# Altium schematic sheet Saturn_Cartage.SchDoc
size A3
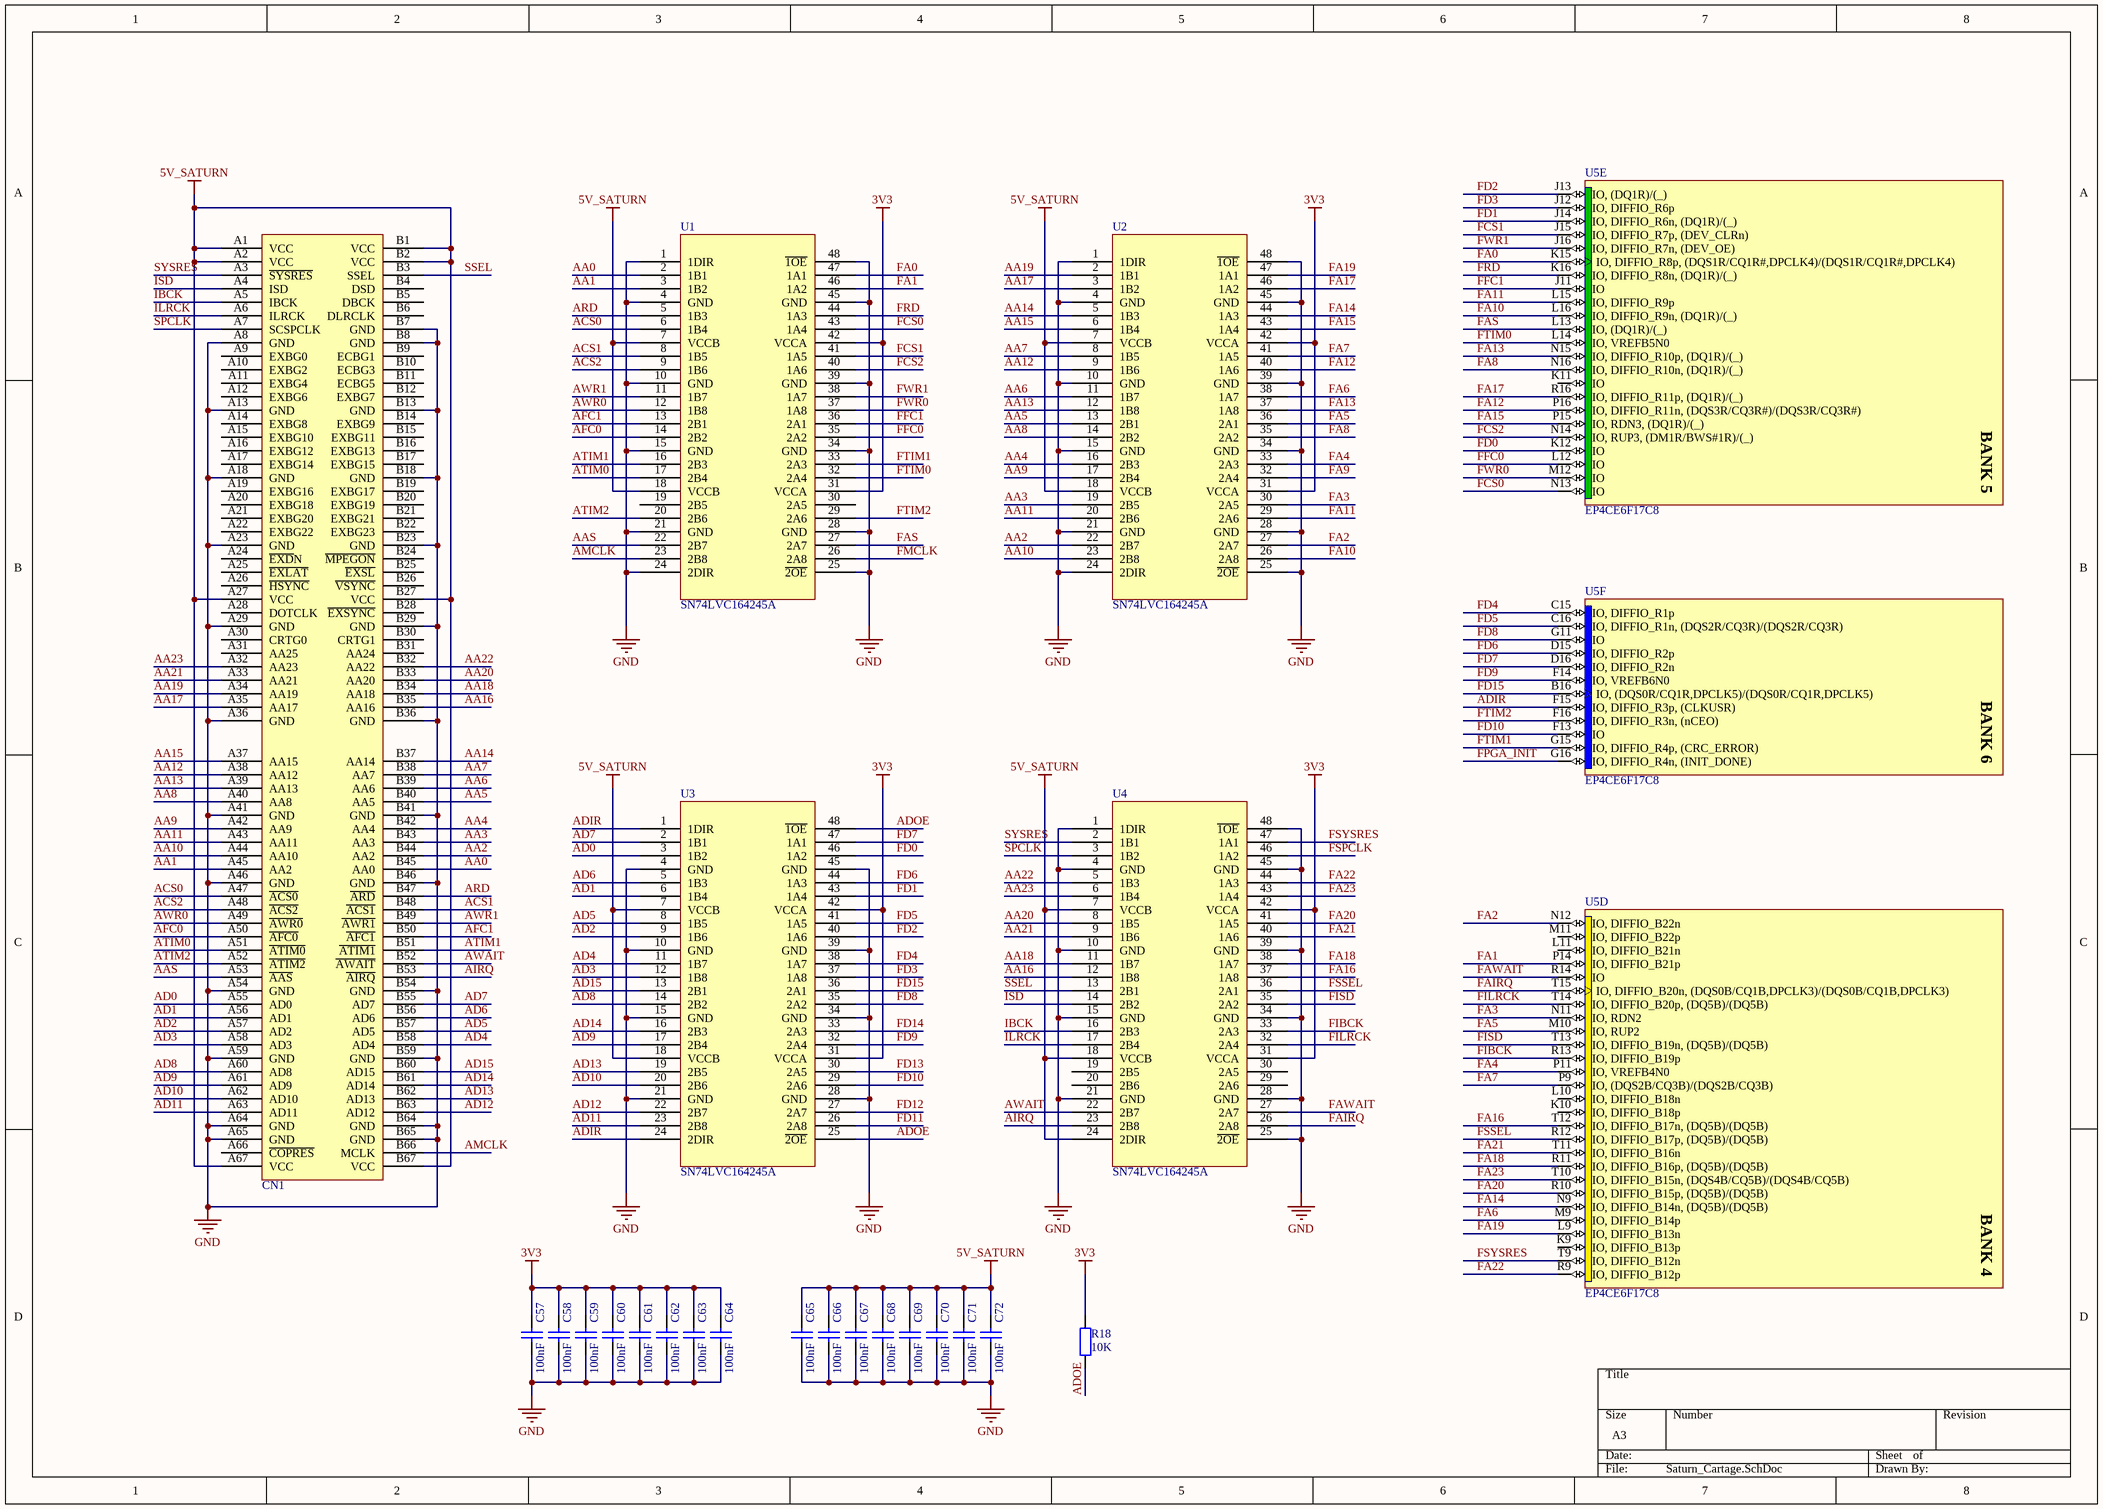
[diagram p0: Saturn_Cartage.SchDoc]

## Parts
C57  100nF  [C0603]
C58  100nF  [C0603]
C59  100nF  [C0603]
C60  100nF  [C0603]
C61  100nF  [C0603]
C62  100nF  [C0603]
C63  100nF  [C0603]
C64  100nF  [C0603]
C65  100nF  [C0603]
C66  100nF  [C0603]
C67  100nF  [C0603]
C68  100nF  [C0603]
C69  100nF  [C0603]
C70  100nF  [C0603]
C71  100nF  [C0603]
C72  100nF  [C0603]
CN1  SaturnCartage  [Saturn_cart]  (value not drawn)
R18  10K  [R0603]
U1  SN74LVC164245A  [DGG048]
U2  SN74LVC164245A  [DGG048]
U3  SN74LVC164245A  [DGG048]
U4  SN74LVC164245A  [DGG048]
U5  EP4CE6F17C8  [FBGA256]  (parts D,E,F of 13)

## Nets
3V3: C57.2 C58.2 C59.2 C60.2 C61.2 C62.2 C63.2 C64.2 R18.2 U1.31(VCCA) U1.42(VCCA) U2.31(VCCA) U2.42(VCCA) U3.31(VCCA) U3.42(VCCA) U4.31(VCCA) U4.42(VCCA)
5V_SATURN: C65.2 C66.2 C67.2 C68.2 C69.2 C70.2 C71.2 C72.2 CN1.A1(VCC) CN1.A2(VCC) CN1.A27(VCC) CN1.A67(VCC) CN1.B1(VCC) CN1.B2(VCC) CN1.B27(VCC) CN1.B67(VCC) U1.7(VCCB) U1.18(VCCB) U2.7(VCCB) U2.18(VCCB) U3.7(VCCB) U3.18(VCCB) U4.7(VCCB) U4.18(VCCB) U4.24(2DIR)
GND: C57.1 C58.1 C59.1 C60.1 C61.1 C62.1 C63.1 C64.1 C65.1 C66.1 C67.1 C68.1 C69.1 C70.1 C71.1 C72.1 CN1.A8(GND) CN1.A13(GND) CN1.A18(GND) CN1.A23(GND) CN1.A29(GND) CN1.A36(GND) CN1.A41(GND) CN1.A46(GND) CN1.A54(GND) CN1.A59(GND) CN1.A64(GND) CN1.A65(GND) CN1.B7(GND) CN1.B8(GND) CN1.B13(GND) CN1.B18(GND) CN1.B23(GND) CN1.B29(GND) CN1.B36(GND) CN1.B41(GND) CN1.B46(GND) CN1.B54(GND) CN1.B59(GND) CN1.B64(GND) CN1.B65(GND) U1.1(1DIR) U1.4(GND) U1.10(GND) U1.15(GND) U1.21(GND) U1.24(2DIR) U1.25(~{2OE}) U1.28(GND) U1.34(GND) U1.39(GND) U1.45(GND) U1.48(~{1OE}) U2.1(1DIR) U2.4(GND) U2.10(GND) U2.15(GND) U2.21(GND) U2.24(2DIR) U2.25(~{2OE}) U2.28(GND) U2.34(GND) U2.39(GND) U2.45(GND) U2.48(~{1OE}) U3.4(GND) U3.10(GND) U3.15(GND) U3.21(GND) U3.28(GND) U3.34(GND) U3.39(GND) U3.45(GND) U4.1(1DIR) U4.4(GND) U4.10(GND) U4.15(GND) U4.21(GND) U4.25(~{2OE}) U4.28(GND) U4.34(GND) U4.39(GND) U4.45(GND) U4.48(~{1OE})
AA0: CN1.B45(AA0) U1.2(1B1)
AA1: CN1.A45(AA2) U1.3(1B2)
AA2: CN1.B44(AA2) U2.22(2B7)
AA3: CN1.B43(AA3) U2.19(2B5)
AA4: CN1.B42(AA4) U2.16(2B3)
AA5: CN1.B40(AA5) U2.13(2B1)
AA6: CN1.B39(AA6) U2.11(1B7)
AA7: CN1.B38(AA7) U2.8(1B5)
AA8: CN1.A40(AA8) U2.14(2B2)
AA9: CN1.A42(AA9) U2.17(2B4)
AA10: CN1.A44(AA10) U2.23(2B8)
AA11: CN1.A43(AA11) U2.20(2B6)
AA12: CN1.A38(AA12) U2.9(1B6)
AA13: CN1.A39(AA13) U2.12(1B8)
AA14: CN1.B37(AA14) U2.5(1B3)
AA15: CN1.A37(AA15) U2.6(1B4)
AA16: CN1.B35(AA16) U4.12(1B8)
AA17: CN1.A35(AA17) U2.3(1B2)
AA18: CN1.B34(AA18) U4.11(1B7)
AA19: CN1.A34(AA19) U2.2(1B1)
AA20: CN1.B33(AA20) U4.8(1B5)
AA21: CN1.A33(AA21) U4.9(1B6)
AA22: CN1.B32(AA22) U4.5(1B3)
AA23: CN1.A32(AA23) U4.6(1B4)
AAS: CN1.A53(~{AAS}) U1.22(2B7)
ACS0: CN1.A47(~{ACS0}) U1.6(1B4)
ACS1: CN1.B48(~{ACS1}) U1.8(1B5)
ACS2: CN1.A48(~{ACS2}) U1.9(1B6)
AD0: CN1.A55(AD0) U3.3(1B2)
AD1: CN1.A56(AD1) U3.6(1B4)
AD2: CN1.A57(AD2) U3.9(1B6)
AD3: CN1.A58(AD3) U3.12(1B8)
AD4: CN1.B58(AD4) U3.11(1B7)
AD5: CN1.B57(AD5) U3.8(1B5)
AD6: CN1.B56(AD6) U3.5(1B3)
AD7: CN1.B55(AD7) U3.2(1B1)
AD8: CN1.A60(AD8) U3.14(2B2)
AD9: CN1.A61(AD9) U3.17(2B4)
AD10: CN1.A62(AD10) U3.20(2B6)
AD11: CN1.A63(AD11) U3.23(2B8)
AD12: CN1.B63(AD12) U3.22(2B7)
AD13: CN1.B62(AD13) U3.19(2B5)
AD14: CN1.B61(AD14) U3.16(2B3)
AD15: CN1.B60(AD15) U3.13(2B1)
ADIR: U3.1(1DIR) U3.24(2DIR) U5.F15(IO,_DIFFIO_R3p,_(CLKUSR))
ADOE: R18.1 U3.25(~{2OE}) U3.48(~{1OE})
AFC0: CN1.A50(~{AFC0}) U1.14(2B2)
AFC1: CN1.B50(~{AFC1}) U1.13(2B1)
AIRQ: CN1.B53(~{AIRQ}) U4.23(2B8)
AMCLK: CN1.B66(MCLK) U1.23(2B8)
ARD: CN1.B47(~{ARD}) U1.5(1B3)
ATIM0: CN1.A51(~{ATIM0}) U1.17(2B4)
ATIM1: CN1.B51(~{ATIM1}) U1.16(2B3)
ATIM2: CN1.A52(~{ATIM2}) U1.20(2B6)
AWAIT: CN1.B52(~{AWAIT}) U4.22(2B7)
AWR0: CN1.A49(~{AWR0}) U1.12(1B8)
AWR1: CN1.B49(~{AWR1}) U1.11(1B7)
FA0: U1.47(1A1) U5.K15(IO,_DIFFIO_R8p,_(DQS1R/CQ1R#,DPCLK4)/(DQS1R/CQ1R#,DPCLK4))
FA1: U1.46(1A2) U5.P14(IO,_DIFFIO_B21p)
FA2: U2.27(2A7) U5.N12(IO,_DIFFIO_B22n)
FA3: U2.30(2A5) U5.N11(IO,_RDN2)
FA4: U2.33(2A3) U5.P11(IO,_VREFB4N0)
FA5: U2.36(2A1) U5.M10(IO,_RUP2)
FA6: U2.38(1A7) U5.M9(IO,_DIFFIO_B14p)
FA7: U2.41(1A5) U5.P9(IO,_(DQS2B/CQ3B)/(DQS2B/CQ3B))
FA8: U2.35(2A2) U5.N16(IO,_DIFFIO_R10n,_(DQ1R)/(_))
FA9: U2.32(2A4)
FA10: U2.26(2A8) U5.L16(IO,_DIFFIO_R9n,_(DQ1R)/(_))
FA11: U2.29(2A6) U5.L15(IO,_DIFFIO_R9p)
FA12: U2.40(1A6) U5.P16(IO,_DIFFIO_R11n,_(DQS3R/CQ3R#)/(DQS3R/CQ3R#))
FA13: U2.37(1A8) U5.N15(IO,_DIFFIO_R10p,_(DQ1R)/(_))
FA14: U2.44(1A3) U5.N9(IO,_DIFFIO_B14n,_(DQ5B)/(DQ5B))
FA15: U2.43(1A4) U5.P15(IO,_RDN3,_(DQ1R)/(_))
FA16: U4.37(1A8) U5.T12(IO,_DIFFIO_B17n,_(DQ5B)/(DQ5B))
FA17: U2.46(1A2) U5.R16(IO,_DIFFIO_R11p,_(DQ1R)/(_))
FA18: U4.38(1A7) U5.R11(IO,_DIFFIO_B16p,_(DQ5B)/(DQ5B))
FA19: U2.47(1A1) U5.L9(IO,_DIFFIO_B13n)
FA20: U4.41(1A5) U5.R10(IO,_DIFFIO_B15p,_(DQ5B)/(DQ5B))
FA21: U4.40(1A6) U5.T11(IO,_DIFFIO_B16n)
FA22: U4.44(1A3) U5.R9(IO,_DIFFIO_B12p)
FA23: U4.43(1A4) U5.T10(IO,_DIFFIO_B15n,_(DQS4B/CQ5B)/(DQS4B/CQ5B))
FAIRQ: U4.26(2A8) U5.T15(IO,_DIFFIO_B20n,_(DQS0B/CQ1B,DPCLK3)/(DQS0B/CQ1B,DPCLK3))
FAS: U1.27(2A7) U5.L13(IO,_(DQ1R)/(_))
FAWAIT: U4.27(2A7) U5.R14(IO)
FCS0: U1.43(1A4) U5.N13(IO)
FCS1: U1.41(1A5) U5.J15(IO,_DIFFIO_R7p,_(DEV_CLRn))
FCS2: U1.40(1A6) U5.N14(IO,_RUP3,_(DM1R/BWS#1R)/(_))
FD0: U3.46(1A2) U5.K12(IO)
FD1: U3.43(1A4) U5.J14(IO,_DIFFIO_R6n,_(DQ1R)/(_))
FD2: U3.40(1A6) U5.J13(IO,_(DQ1R)/(_))
FD3: U3.37(1A8) U5.J12(IO,_DIFFIO_R6p)
FD4: U3.38(1A7) U5.C15(IO,_DIFFIO_R1p)
FD5: U3.41(1A5) U5.C16(IO,_DIFFIO_R1n,_(DQS2R/CQ3R)/(DQS2R/CQ3R))
FD6: U3.44(1A3) U5.D15(IO,_DIFFIO_R2p)
FD7: U3.47(1A1) U5.D16(IO,_DIFFIO_R2n)
FD8: U3.35(2A2) U5.G11(IO)
FD9: U3.32(2A4) U5.F14(IO,_VREFB6N0)
FD10: U3.29(2A6) U5.F13(IO)
FD11: U3.26(2A8)
FD12: U3.27(2A7)
FD13: U3.30(2A5)
FD14: U3.33(2A3)
FD15: U3.36(2A1) U5.B16(IO,_(DQS0R/CQ1R,DPCLK5)/(DQS0R/CQ1R,DPCLK5))
FFC0: U1.35(2A2) U5.L12(IO)
FFC1: U1.36(2A1) U5.J11(IO)
FIBCK: U4.33(2A3) U5.R13(IO,_DIFFIO_B19p)
FILRCK: U4.32(2A4) U5.T14(IO,_DIFFIO_B20p,_(DQ5B)/(DQ5B))
FISD: U4.35(2A2) U5.T13(IO,_DIFFIO_B19n,_(DQ5B)/(DQ5B))
FMCLK: U1.26(2A8)
FPGA_INIT: U5.G16(IO,_DIFFIO_R4n,_(INIT_DONE))
FRD: U1.44(1A3) U5.K16(IO,_DIFFIO_R8n,_(DQ1R)/(_))
FSPCLK: U4.46(1A2)
FSSEL: U4.36(2A1) U5.R12(IO,_DIFFIO_B17p,_(DQ5B)/(DQ5B))
FSYSRES: U4.47(1A1) U5.T9(IO,_DIFFIO_B12n)
FTIM0: U1.32(2A4) U5.L14(IO,_VREFB5N0)
FTIM1: U1.33(2A3) U5.G15(IO,_DIFFIO_R4p,_(CRC_ERROR))
FTIM2: U1.29(2A6) U5.F16(IO,_DIFFIO_R3n,_(nCEO))
FWR0: U1.37(1A8) U5.M12(IO)
FWR1: U1.38(1A7) U5.J16(IO,_DIFFIO_R7n,_(DEV_OE))
IBCK: CN1.A5(IBCK) U4.16(2B3)
ILRCK: CN1.A6(ILRCK) U4.17(2B4)
ISD: CN1.A4(ISD) U4.14(2B2)
SPCLK: CN1.A7(SCSPCLK) U4.3(1B2)
SSEL: CN1.B3(SSEL) U4.13(2B1)
SYSRES: CN1.A3(~{SYSRES}) U4.2(1B1)

Not connected (* = marked no-connect by the designer): CN1 A9(EXBG0) A10(EXBG2) A11(EXBG4) A12(EXBG6) A14(EXBG8) A15(EXBG10) A16(EXBG12) A17(EXBG14) A19(EXBG16) A20(EXBG18) A21(EXBG20) A22(EXBG22) A24(~{EXD}N) A25(~{EXLAT}) A26(~{HSYNC}) A28(DOTCLK) A30(CRTG0) A31(AA25) A66(~{COPRES}) B4(DSD) B5(DBCK) B6(DLRCLK) B9(ECBG1) B10(ECBG3) B11(ECBG5) B12(EXBG7) B14(EXBG9) B15(EXBG11) B16(EXBG13) B17(EXBG15) B19(EXBG17) B20(EXBG19) B21(EXBG21) B22(EXBG23) B24(~{MPEGON}) B25(~{EXSL}) B26(~{VSYNC}) B28(~{EXSYNC}) B30(CRTG1) B31(AA24); U1 19(2B5) 30(2A5); U4 19(2B5) 20(2B6) 29(2A6) 30(2A5); U5 K9(IO,_DIFFIO_B13p) K10(IO,_DIFFIO_B18p) K11(IO) L10(IO,_DIFFIO_B18n) L11(IO,_DIFFIO_B21n) M11(IO,_DIFFIO_B22p)

## Notes on the sheet
- (in symbol EP4CE6F17C8, part D) BANK 4
- (in symbol EP4CE6F17C8, part E) BANK 5
- (in symbol EP4CE6F17C8, part F) BANK 6

## Library data of the parts
C57-C72 = Cap: Capacitor; Published: 8-Jun-2000; LatestRevisionDate: 17-Jul-2002; LatestRevisionNote: Re-released for DXP Platform.; PackageReference: RAD-0.3; Publisher: Altium Limited
R18 = Res2: Resistor; Published: 8-Jun-2000; LatestRevisionDate: 17-Jul-2002; LatestRevisionNote: Re-released for DXP Platform.; PackageReference: AXIAL-0.4; Publisher: Altium Limited
U5 = EP4CE6F17C8: Cyclone IV Family FPGA, 2V Core, 179 I/O Pins, 2 PLLs, 256-Pin FBGA, Speed Grade 8, Commercial Grade; Published: 3-May-2010; DatasheetVersion: ver1.2, Mar-2010; PackageVersion: ver16.0, Dec-2009; PackageReference: FBGA256; Publisher: Altium Limited; PackageDescription: 256-Ball FineLine Ball Grid Array (FBGA256) - Option 1 - Wire Bond; Code_JEDEC: MS-034-AAF-1; Code_IPC: BGA100P16X16-256; ComponentLink1Description: Manufacturer Link; ComponentLink1URL: http://www.altera.com/; ComponentLink2Description: Handbook; ComponentLink2URL: http://www.altera.com/literature/hb/cyclone-iv/cyclone4-handbook.pdf; ComponentLink3Description: Pinout Specification; ComponentLink3URL: http://www.altera.com/literature/lit-dp.jsp?category=cyc%204&showspreadsheet=y; ComponentLink4Description: Packaging Specification; ComponentLink4URL: http://www.altera.com/literature/ds/dspkg.pdf